# EAGLE design jack_breakout (EAGLE 9.6.0)
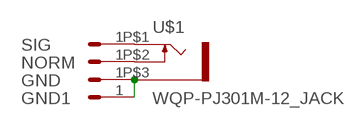
[diagram p0: schematic, sheet 1]

## Parts
GND  HEADER/MALE/01  [HEADER/MALE/01]
GND1  HEADER/MALE/01  [HEADER/MALE/01]
NORM  HEADER/MALE/01  [HEADER/MALE/01]
SIG  HEADER/MALE/01  [HEADER/MALE/01]
U$1  WQP-PJ301M-12_JACK  [WQP-PJ301M-12_JACK]

## Nets
N$1: SIG.1 U$1.P$1
N$2: NORM.1 U$1.P$2
N$3: GND1.1 GND.1 U$1.P$3

## Library data of the parts
GND GND1 NORM SIG = connectors:HEADER/MALE/01
U$1 = controls:WQP-PJ301M-12_JACK

## Board
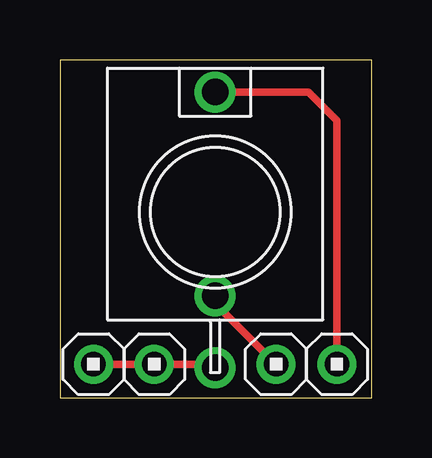
[diagram p1: board, top side]

Size 13 x 14.09 mm. Coordinates in mm from the lower left corner, seen from the top.
Outline: 0,0 13,0 13,14.09 0,14.09 0,0
Copper layers (1*16): Top 0.0356mm / dielectric 1.5011mm / Bottom 0.0356mm
Design rules "pigatron": minimum track width 12mil, minimum drill 13mil, track to track 15mil, track to pad 10mil, pad to pad 10mil, via to via 10mil, smd to smd 6mil, copper to edge 15mil, drill to drill 10mil, minimum pad ring 12mil, minimum via ring 10mil, stop-mask expansion 4mil, vias tented up to drill 0mil, thermal gap 10mil

### Footprints (pad centres in the part's own frame; a part is rotated, then mirrored left to right if it is on the bottom)
HEADER/MALE/01 = drill 1.016: 1 0,0
WQP-PJ301M-12_JACK = drill 1.1: P$1 0,5; P$2 0,-3.5; P$3 0,-6.5

### Placement (x,y rotation side)
GND  1.4,1.4 90 top
GND1  3.94,1.4 90 top
NORM  9.02,1.4 90 top
SIG  11.56,1.4 90 top
U$1  6.48,7.75 0 top

### Tracks (layer width: path | path; a pad name or v marks a point on that pad's centre or on a via)
N$1
  Top 0.305: SIG.1 11.56,11.56 10.37,12.75 U$1.P$1
N$2
  Top 0.305: NORM.1 6.48,3.94 U$1.P$2
N$3
  Top 0.305: U$1.P$3 6.33,1.4 GND1.1 GND.1